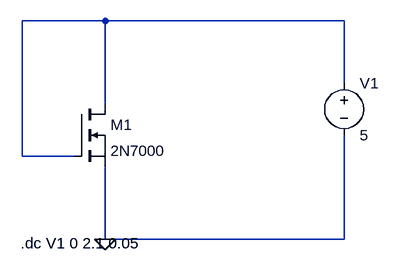
[diagram p0: schematic scheme1.asc]
scheme1.asc, the LTspice schematic file:
Version 4
SHEET 1 880 680
WIRE 336 16 208 16
WIRE 704 16 336 16
WIRE 704 112 704 16
WIRE 336 144 336 16
WIRE 208 224 208 16
WIRE 288 224 208 224
WIRE 336 352 336 240
WIRE 704 352 704 192
WIRE 704 352 336 352
FLAG 336 352 0
SYMBOL nmos 288 144 R0
SYMATTR InstName M1
SYMATTR Value 2N7000
SYMBOL voltage 704 96 R0
WINDOW 123 0 0 Left 2
WINDOW 39 0 0 Left 2
SYMATTR InstName V1
SYMATTR Value 5
TEXT 206 358 Left 2 !.dc V1 0 2.1 0.05

The netlist it stands for:
* scheme1.asc
M1 N001 N001 0 0 2N7000
V1 N001 0 5
.model NMOS NMOS
.model PMOS PMOS
.lib standard.mos
.dc V1 0 2.1 0.05
.backanno
.end